# Altium schematic sheet Singlepath.SchDoc
size A4; SheetNumber: 10; SheetTotal: 10
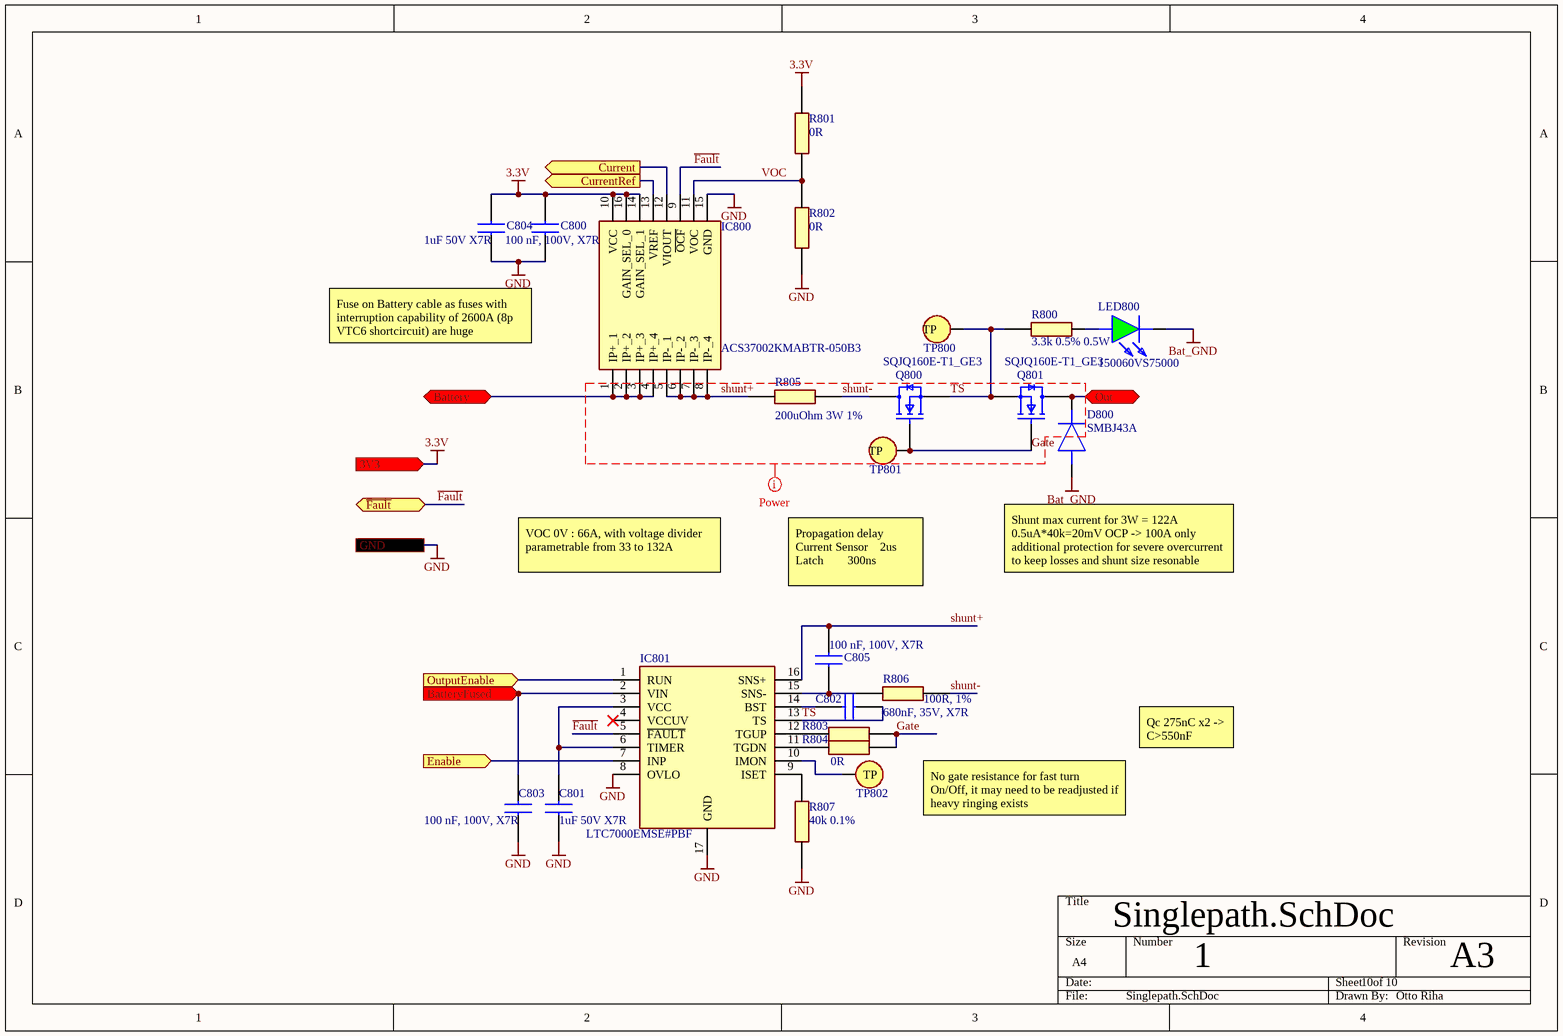
[diagram p0: Singlepath.SchDoc]

## Parts
C800  100 nF, 100V, X7R  [MAJx16]
C801  1uF 50V X7R  [CAPC1608X90N]
C802  680nF, 35V, X7R  [CAPC1608X90N]
C803  100 nF, 100V, X7R  [MAJx16]
C804  1uF 50V X7R  [CAPC1608X90N]
C805  100 nF, 100V, X7R  [MAJx16]
D800  SMBJ43A  [DIOM5436X244N]
IC800  ACS37002KMABTR-050B3  [SOIC127P1030X265-16N]
IC801  LTC7000EMSE#PBF  [SOP50P490X110-17N]
LED800  150060VS75000  [LEDC1608X80N]
Q800  SQJQ160E-T1_GE3  [SQJQ160ET1_GE3]
Q801  SQJQ160E-T1_GE3  [SQJQ160ET1_GE3]
R800  3.3k 0.5% 0.5W  [ERJP06D1000V]
R801  value 0R  [RESC1608X50N]  (hidden comment: 0Ohm)
R802  value 0R  [RESC1608X50N]  (hidden comment: 0Ohm)
R803  value 0R  [RESC1608X50N]  (hidden comment: 0Ohm)
R804  0Ohm  [RESC1608X50N]  (value not drawn)
R805  200uOhm 3W 1%  [RESC10052X63N]
R806  100R, 1%  [RESC1608X50N]
R807  40k 0.1%  [RESC1608X55N]
TP800  Testpoint  [Testpoint]  (value not drawn)
TP801  Testpoint  [Testpoint]  (value not drawn)
TP802  Testpoint  [Testpoint]  (value not drawn)

## Ports
3V3 (in, see PowerPath[2B], AuxSupply_USB[2D], MCU[1A], PowerPath[1B]), Battery (bidir, see PowerPath[2A], PowerPath[1A]), BatteryFused (in, see PowerPath[2B], PowerPath[1B]), Current (out, see PowerPath[2B]), CurrentRef (out, see PowerPath[2B]), Enable (in, see PowerPath[2B]), GND (see PowerPath[2B], AuxSupply_USB[1C], LTC_Hardware[1D], MCU[1A], PowerPath[1B]), Out (bidir, see PowerPath[2B]), OutputEnable (in, see PowerPath[2B], MCU[3C], PowerPath[2D]), ~{Fault} (bidir, see PowerPath[2B])

## Nets
3.3V: C800.2 C804.2 IC800.10(VCC) IC800.14(GAIN_SEL_1) IC800.16(GAIN_SEL_0) R801.2 ; port 3V3
Bat_GND: D800.2(A) LED800.1(K)
GND: C800.1 C801.1 C803.1 C804.1 IC800.15(GND) IC801.8(OVLO) IC801.17(GND) R802.1 R807.1 ; port GND
Battery: IC800.1(IP+_1) IC800.2(IP+_2) IC800.3(IP+_3) IC800.4(IP+_4) ; port Battery
BatteryFused: C803.2 IC801.2(VIN) ; port BatteryFused
Current: IC800.12(VIOUT) ; port Current
CurrentRef: IC800.13(VREF) ; port CurrentRef
Enable: IC801.7(INP) ; port Enable
~{Fault}: IC800.9(~{OCF}) IC801.5(~{FAULT}) ; port ~{Fault}
Gate: Q800.1(G) Q801.1(G) R803.2 R804.2 TP801.1(TP)
Out: D800.1(K) Q801.3(D_1) ; port Out
OutputEnable: IC801.1(RUN) ; port OutputEnable
shunt+: C805.2 IC800.5(IP-_1) IC800.6(IP-_2) IC800.7(IP-_3) IC800.8(IP-_4) IC801.16(SNS+) R805.1
shunt-: Q800.3(D_1) R805.2 R806.2
TS: C802.2 IC801.13(TS) Q800.2(S_1) Q801.2(S_1) R800.1 TP800.1(TP)
VOC: IC800.11(VOC) R801.1 R802.2
NetC801_2: C801.2 IC801.3(VCC) IC801.6(TIMER)
NetC802_1: C802.1 IC801.14(BST)
NetC805_1: C805.1 IC801.15(SNS-) R806.1
NetIC801_9: IC801.9(ISET) R807.2
NetIC801_10: IC801.10(IMON) TP802.1(TP)
NetIC801_11: IC801.11(TGDN) R804.1
NetIC801_12: IC801.12(TGUP) R803.1
NetLED800_2: LED800.2(A) R800.2

Not connected (* = marked no-connect by the designer): IC801 4(VCCUV)*

## Layout directives
net class Batt+: Gate, shunt+, shunt-, TS

## Notes on the sheet
- Fuse on Battery cable as fuses with interruption capability of 2600A (8p VTC6 shortcircuit) are huge
- VOC 0V : 66A, with voltage divider parametrable from 33 to 132A
- Propagation delay
  Current Sensor    2us
  Latch 	      300ns
- (near D800) Shunt max current for 3W = 122A
  0.5uA*40k=20mV OCP -> 100A only additional protection for severe overcurrent to keep losses and shunt size resonable
- Qc 275nC x2 ->
  C>550nF
- No gate resistance for fast turn On/Off, it may need to be readjusted if heavy ringing exists
- 1
- A3
- Otto Riha

## Library data of the parts
C800 C803 C805 = MAJCH168BB7104KTEA01: Capacitor 100nF, 100V, X7R; Manufacturer_Name: TAIYO YUDEN; Datasheet Link: https://ds.yuden.co.jp/TYCOMPAS/or/detail?pn=MAJCH168BB7104KTEA01; Height: 0.8mm; Manufacturer_Part_Number: MAJCH168BB7104KTEA01; Mouser Part Number: 963-MAJCH168BB7104KT; Mouser Price/Stock: https://www.mouser.co.uk/ProductDetail/TAIYO-YUDEN/MAJCH168BB7104KTEA01?qs=ZcfC38r4PovaTBrG0IdezQ%3D%3D; Arrow Part Number: MAJCH168BB7104KTEA01; Arrow Price/Stock: https://www.arrow.com/en/products/majch168bb7104ktea01/taiyo-yuden?utm_currency=USD&region=nac; Supplier 1: Mouser; Supplier Part Number 1: 963-MAJCH168BB7104KT
C801 C804 = 06035C105MAT2A: Capacitor 1uF 50V X7R; Manufacturer_Name: Kyocera AVX; Datasheet Link: https://componentsearchengine.com/Datasheets/1/06031A100FAT2A.pdf; Height: 0.9mm; Manufacturer_Part_Number: 06035C105MAT2A; Mouser Part Number: 581-06035C105MAT2A; Mouser Price/Stock: https://www.mouser.co.uk/ProductDetail/KYOCERA-AVX/06035C105MAT2A?qs=%252BdQmOuGyFcHMsevPtc6OZQ%3D%3D; Value: 1uF
C802 = CGA3E1X7R1V684K080AC: Capacitor 680nF, 35V, X7R; Manufacturer_Name: TDK; Datasheet Link: http://docs-europe.electrocomponents.com/webdocs/14e9/0900766b814e9125.pdf; Height: 0.9mm; Manufacturer_Part_Number: CGA3E1X7R1V684K080AC; Mouser Part Number: 810-CGA3E1X7R1V684KC; Supplier 1: Mouser; Supplier Part Number 1: 810-CGA3E1X7R1V684KC
D800 = SMBJ43A: Diode; Manufacturer_Name: LITTELFUSE; Datasheet Link: https://componentsearchengine.com/Datasheets/2/SMBJ43A.pdf; Height: 2.44mm; Manufacturer_Part_Number: SMBJ43A; Mouser Part Number: 576-SMBJ43A; Mouser Price/Stock: https://www.mouser.co.uk/ProductDetail/Littelfuse/SMBJ43A?qs=zHiv0nsVGmoMbQaEc1ZdvQ%3D%3D; Arrow Part Number: SMBJ43A; Arrow Price/Stock: https://www.arrow.com/en/products/smbj43a/littelfuse?region=nac
IC800 = ACS37002KMABTR-050B3: Integrated Circuit; Manufacturer_Name: Allegro Microsystems; Datasheet Link: https://www.allegromicro.com/-/media/files/datasheets/acs37002-datasheet.ashx?sc_lang=en&hash=FFD236A6D18C7717C5A7906548FB48D2; Height: 2.65mm; Manufacturer_Part_Number: ACS37002KMABTR-050B3; Mouser Part Number: 250-37002KMABTR050B3; Mouser Price/Stock: https://www.mouser.co.uk/ProductDetail/Allegro-MicroSystems/ACS37002KMABTR-050B3?qs=pUKx8fyJudCSE%2FoW6XxDYQ%3D%3D
IC801 = LTC7000EMSE#PBF: Integrated Circuit; Manufacturer_Name: Analog Devices; Datasheet Link: https://www.analog.com/media/en/technical-documentation/data-sheets/ltc7000-7000-1.pdf; Height: 1.1mm; Manufacturer_Part_Number: LTC7000EMSE#PBF; Mouser Part Number: 584-LTC7000EMSEPBF; Mouser Price/Stock: https://www.mouser.co.uk/ProductDetail/Analog-Devices/LTC7000EMSEPBF?qs=BZBei1rCqCABaEvAxqf5Sw%3D%3D; Arrow Part Number: LTC7000EMSE#PBF; Arrow Price/Stock: https://www.arrow.com/en/products/ltc7000emsepbf/analog-devices?region=nac
LED800 = 150060VS75000: LED; Manufacturer_Name: Wurth Elektronik; Datasheet Link: https://componentsearchengine.com/Datasheets/2/150060VS75000.pdf; Height: 0.8mm; Manufacturer_Part_Number: 150060VS75000; Mouser Part Number: 710-150060VS75000; Mouser Price/Stock: https://www.mouser.co.uk/ProductDetail/Wurth-Elektronik/150060VS75000?qs=LlUlMxKIyB1Q1Bi5mQ%2FKLw%3D%3D
Q800 Q801 = SQJQ160E-T1_GE3: MOSFET (N-Channel); Manufacturer_Name: Vishay; Datasheet Link: https://www.vishay.com/docs/63059/sqjq160e.pdf; Height: 1.65mm; Manufacturer_Part_Number: SQJQ160E-T1_GE3; Mouser Part Number: 78-SQJQ160E-T1_GE3; Mouser Price/Stock: https://www.mouser.co.uk/ProductDetail/Vishay-Semiconductors/SQJQ160E-T1_GE3?qs=Wj%2FVkw3K%252BMDBWZlqh0rWDw%3D%3D
R800 = ERJ-P06J332V: Resistor; Manufacturer_Name: Panasonic; Datasheet Link: http://industrial.panasonic.com/cdbs/www-data/pdf/RDA0000/AOA0000C102.pdf; Height: 0.7mm; Manufacturer_Part_Number: ERJ-P06J332V; Mouser Part Number: 667-ERJ-P06J332V; Mouser Price/Stock: https://www.mouser.co.uk/ProductDetail/Panasonic/ERJ-P06J332V?qs=Zyl8A9hlmJrue%2FwxovXuCg%3D%3D; Arrow Part Number: ERJ-P06J332V; Arrow Price/Stock: https://www.arrow.com/en/products/erj-p06j332v/panasonic
R801-R803 = CRCW06030000Z0EC: Resistor; Manufacturer_Name: Vishay; Datasheet Link: http://www.vishay.com/docs/20035/dcrcwe3.pdf; Height: 0.5mm; Manufacturer_Part_Number: CRCW06030000Z0EC; Mouser Part Number: 71-CRCW06030000Z0EC; Mouser Price/Stock: https://www.mouser.co.uk/ProductDetail/Vishay-Dale/CRCW06030000Z0EC?qs=5Vo7YKalRVV5nT3RQodYAA%3D%3D; Arrow Part Number: CRCW06030000Z0EC; Arrow Price/Stock: https://www.arrow.com/en/products/crcw06030000z0ec/vishay?utm_currency=USD&region=nac
R804 = CRCW06030000Z0EC: Resistor; Manufacturer_Name: Vishay; Value: 0R; Datasheet Link: http://www.vishay.com/docs/20035/dcrcwe3.pdf; Height: 0.5mm; Manufacturer_Part_Number: CRCW06030000Z0EC; Mouser Part Number: 71-CRCW06030000Z0EC; Mouser Price/Stock: https://www.mouser.co.uk/ProductDetail/Vishay-Dale/CRCW06030000Z0EC?qs=5Vo7YKalRVV5nT3RQodYAA%3D%3D; Arrow Part Number: CRCW06030000Z0EC; Arrow Price/Stock: https://www.arrow.com/en/products/crcw06030000z0ec/vishay?utm_currency=USD&region=nac
R805 = PU3921FKN130U2L: Resistor; Manufacturer_Name: YAGEO; Datasheet Link: https://www.yageo.com/upload/media/product/app/datasheet/rchip/pyu-pu_51_rohs_l.pdf; Height: 0.63mm; Manufacturer_Part_Number: PU3921FKN130U2L; Mouser Part Number: 603-PU3921FKN130U2L; Mouser Price/Stock: https://www.mouser.co.uk/ProductDetail/YAGEO/PU3921FKN130U2L?qs=Yv%2FzsQ5pz3Hao%2Fr%2FiAcpvw%3D%3D; Arrow Part Number: PU3921FKN130U2L; Arrow Price/Stock: https://www.arrow.com/en/products/pu3921fkn130u2l/yageo?utm_currency=USD&region=nac
R806 = CRCW0603100RFKEA: Resistor 100R, 1%; Manufacturer_Name: Vishay; Datasheet Link: http://www.vishay.com/docs/20035/dcrcwe3.pdf; Height: 0.5mm; Manufacturer_Part_Number: CRCW0603100RFKEA; Mouser Part Number: 71-CRCW0603-100-E3; Mouser Price/Stock: https://www.mouser.co.uk/ProductDetail/Vishay-Dale/CRCW0603100RFKEA?qs=90AHS1y%2FsidGWjjxZAupKg%3D%3D; Arrow Part Number: CRCW0603100RFKEA; Arrow Price/Stock: https://www.arrow.com/en/products/crcw0603100rfkea/vishay?utm_currency=USD&region=europe; Supplier 1: Mouser; Supplier Part Number 1: 71-CRCW0603-100-E3; Value: 100R
R807 = AT0603BRD0740KL: Resistor; Manufacturer_Name: YAGEO; Datasheet Link: https://pt.mouser.com/datasheet/2/447/PYu_AT_51_RoHS_L_6-3003058.pdf; Height: 0.55mm; Manufacturer_Part_Number: AT0603BRD0740KL; Mouser Part Number: 603-AT0603BRD0740KL